# Altium schematic sheet Power.SchDoc
size A4
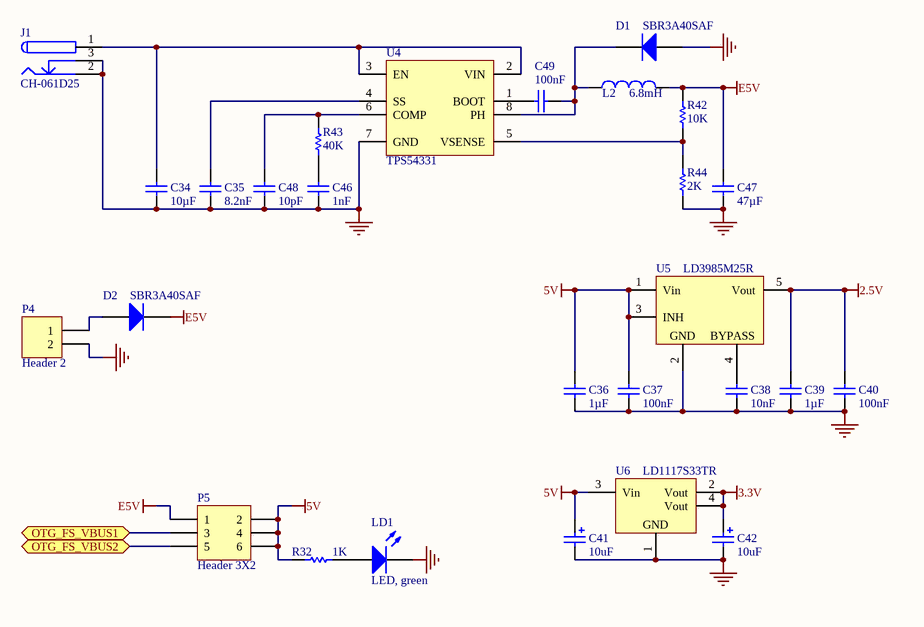
[diagram p0: Power.SchDoc]

## Parts
C34  value 10µF  [CAPC3216N]  (hidden comment: Cap)
C35  value 8.2nF  [CAPC2012N]  (hidden comment: Cap)
C36  value 1µF  [CAPC3216N]  (hidden comment: Cap)
C37  value 100nF  [CAPC2012N]  (hidden comment: Cap)
C38  value 10nF  [CAPC2012N]  (hidden comment: Cap)
C39  value 1µF  [CAPC3216N]  (hidden comment: Cap)
C40  value 100nF  [CAPC2012N]  (hidden comment: Cap)
C41  value 10uF  [TC3216-1206]  (hidden comment: Cap Pol)
C42  value 10uF  [TC3216-1206]  (hidden comment: Cap Pol)
C46  value 1nF  [CAPC2012N]  (hidden comment: Cap)
C47  value 47µF  [CAPC3216N]  (hidden comment: Cap)
C48  value 10pF  [CAPC2012N]  (hidden comment: Cap)
C49  value 100nF  [CAPC2012N]  (hidden comment: Cap)
D1  SBR3A40SAF  [CD-DO214AC]
D2  SBR3A40SAF  [CD-DO214AC]
J1  CH-061D25  [CH-061D25]
L2  value 6.8mH  [INDP6560X45M]  (hidden comment: Inductor)
LD1  LED, green  [CLED2012-0805]
P4  Header 2  [HDR1X2H]
P5  Header 3X2  [HDR2X3]
R32  value 1K  [RESC2012N]  (hidden comment: 1206)
R42  value 10K  [RESC2012N]  (hidden comment: Res)
R43  value 40K  [RESC2012N]  (hidden comment: Res)
R44  value 2K  [RESC2012N]  (hidden comment: Res)
U4  TPS54331  [SOIC127P600X173-8M]
U5  LD3985M25R  [SOT95P280X145-5M]
U6  LD1117S33TR  [SOT230P700X181-4M]

## Ports
OTG_FS_VBUS1 (bidir), OTG_FS_VBUS2 (bidir)

## Nets
2.5V: C39.2 C40.2 U5.5(Vout)
3.3V: C42.1 U6.2(Vout) U6.4(Vout)
5V: C36.2 C37.2 C41.1 P5.2 P5.4 P5.6 R32.2 U5.1(Vin) U5.3(INH) U6.3(Vin)
DGND: C34.1 C35.1 C36.1 C37.1 C38.1 C39.1 C40.1 C41.2 C42.2 C46.1 C47.1 C48.1 D1.1(A) J1.2 J1.3 LD1.2(K) P4.2 R44.1 U4.7(GND) U5.2(GND) U6.1(GND)
E5V: C47.2 D2.2(K) L2.2 P5.1 R42.2
OTG_FS_VBUS1: P5.3 ; port OTG_FS_VBUS1
OTG_FS_VBUS2: P5.5 ; port OTG_FS_VBUS2
NetC34_2: C34.2 J1.1 U4.2(VIN) U4.3(EN)
NetC35_2: C35.2 U4.4(SS)
NetC38_2: C38.2 U5.4(BYPASS)
NetC46_2: C46.2 R43.1
NetC48_2: C48.2 R43.2 U4.6(COMP)
NetC49_1: C49.1 D1.2(K) L2.1 U4.8(PH)
NetC49_2: C49.2 U4.1(BOOT)
NetD2_1: D2.1(A) P4.1
NetLD1_1: LD1.1(A) R32.1
NetR42_1: R42.1 R44.2 U4.5(VSENSE)

## Library data of the parts
C34-C40 C46-C49 = Cap: Capacitor
C41 C42 = Cap Pol: Polarized Capacitor
D1 D2 = Diode: Default Diode
J1 = PWR2.5: Low Voltage Power Supply Connector
LD1 = LED: Light emitting diode
P4 = Header 2: Header, 2-Pin
P5 = Header 3X2: Header, 3-Pin, Dual row
R32 R42-R44 = Res: Resistor
U4 = TPS54331: 3-A, 28-V Input, Step Down DC-DC Converter With Eco-mode
U5 = LD3985M: Ultra low drop-low noise BiCMOS voltage  regulators low ESR capacitors compatible
U6 = LD1117S: Adjustable and fixed low drop positive voltage regulator